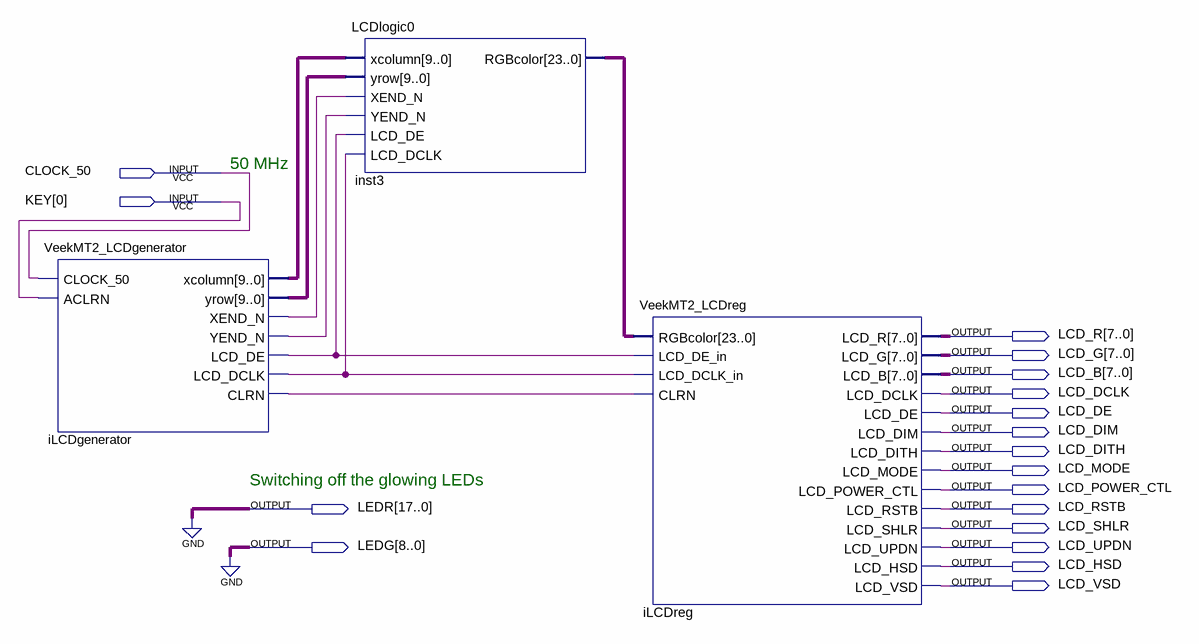
[diagram p0: schematic sheet]
// Quartus schematic Demo_LCD.bdf as structural Verilog: 3 symbols, 18 pins
module Demo_LCD (
  input  CLOCK_50,
  input  [0:0] KEY,
  output [7:0] LCD_R,
  output [7:0] LCD_G,
  output [7:0] LCD_B,
  output LCD_DCLK,
  output LCD_DE,
  output LCD_DIM,
  output LCD_DITH,
  output LCD_MODE,
  output LCD_POWER_CTL,
  output [17:0] LEDR,
  output LCD_RSTB,
  output LCD_SHLR,
  output [8:0] LEDG,
  output LCD_UPDN,
  output LCD_HSD,
  output LCD_VSD
);

  wire iLCDgenerator_clrn, iLCDgenerator_lcd_dclk, iLCDgenerator_lcd_de, iLCDgenerator_xend_n,
       iLCDgenerator_yend_n;
  wire [9:0] iLCDgenerator_xcolumn, iLCDgenerator_yrow;
  wire [23:0] inst3_rgbcolor;

  VeekMT2_LCDgenerator iLCDgenerator (
    .CLOCK_50(CLOCK_50), .ACLRN(KEY[0]), .xcolumn(iLCDgenerator_xcolumn), .yrow(iLCDgenerator_yrow),
    .XEND_N(iLCDgenerator_xend_n), .YEND_N(iLCDgenerator_yend_n), .LCD_DE(iLCDgenerator_lcd_de),
    .LCD_DCLK(iLCDgenerator_lcd_dclk), .CLRN(iLCDgenerator_clrn));
  LCDlogic0 inst3 (
    .xcolumn(iLCDgenerator_xcolumn), .yrow(iLCDgenerator_yrow), .XEND_N(iLCDgenerator_xend_n),
    .YEND_N(iLCDgenerator_yend_n), .LCD_DE(iLCDgenerator_lcd_de), .LCD_DCLK(iLCDgenerator_lcd_dclk),
    .RGBcolor(inst3_rgbcolor));
  VeekMT2_LCDreg iLCDreg (
    .RGBcolor(inst3_rgbcolor), .LCD_DE_in(iLCDgenerator_lcd_de), .LCD_DCLK_in(iLCDgenerator_lcd_dclk),
    .CLRN(iLCDgenerator_clrn), .LCD_R(LCD_R), .LCD_G(LCD_G), .LCD_B(LCD_B), .LCD_DCLK(LCD_DCLK),
    .LCD_DE(LCD_DE), .LCD_DIM(LCD_DIM), .LCD_DITH(LCD_DITH), .LCD_MODE(LCD_MODE),
    .LCD_POWER_CTL(LCD_POWER_CTL), .LCD_RSTB(LCD_RSTB), .LCD_SHLR(LCD_SHLR), .LCD_UPDN(LCD_UPDN),
    .LCD_HSD(LCD_HSD), .LCD_VSD(LCD_VSD));

  assign LEDG = {9{1'b0}};
  assign LEDR = {18{1'b0}};

  // Notes on the sheet:
  //   50 MHz
  //   Switching off the glowing LEDs
endmodule
